# Altium schematic sheet root.SchDoc: LT3001 Eval Board - root
size 431 x 279 mm; Date: 2022-03-23; CompanyName: Team Phantom; Engineer: Justin; Revision: 1; SheetNumber: 1; SheetTotal: 1; Project: EV_LT3001; ItemRevision: 1
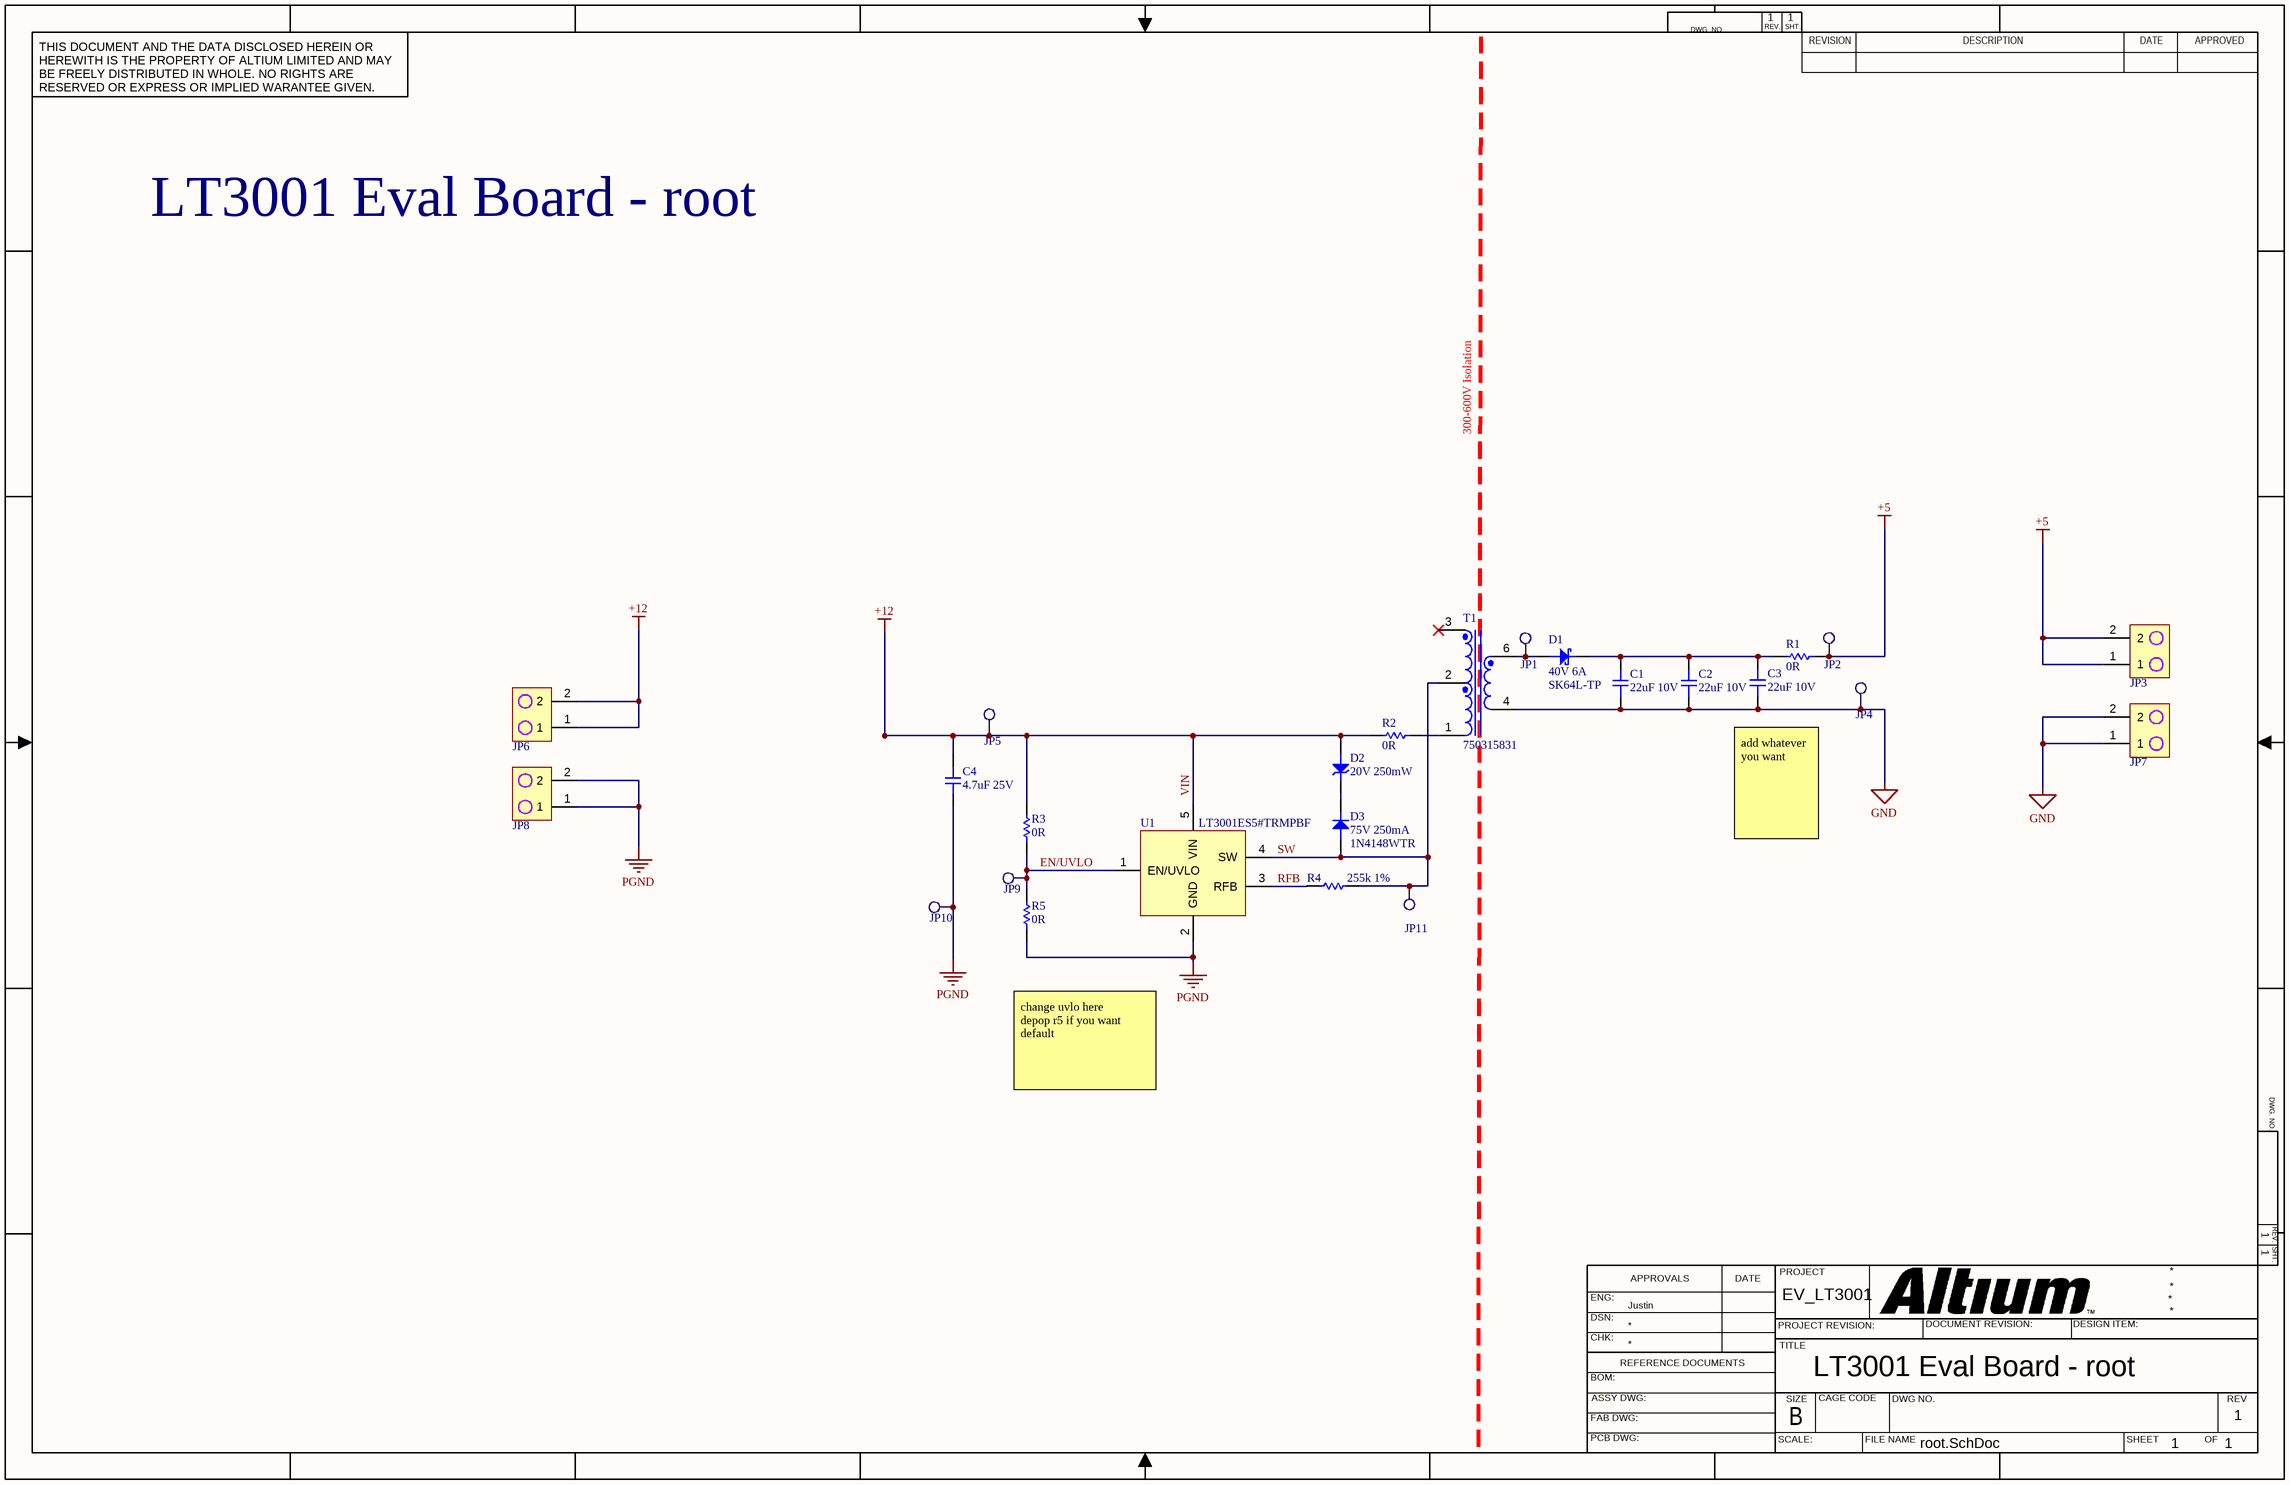
[diagram p0: root.SchDoc]

## Parts
C1  Schematic Label: 22uF 10V  [CAP-0603]  (hidden comment: CL10A226MP8NUNE)
C2  Schematic Label: 22uF 10V  [CAP-0603]  (hidden comment: CL10A226MP8NUNE)
C3  Schematic Label: 22uF 10V  [CAP-0603]  (hidden comment: CL10A226MP8NUNE)
C4  Schematic Label: 4.7uF 25V  [CAP-0805]  (hidden comment: CL21A475KAQNNNE)
D1  Schematic Label: 40V 6A  [Diode-SOD123W]  (hidden comment: SK64L-TP)
D2  Schematic Label: 20V 250mW  [DIODE-SOD323]  (hidden comment: CMDZ5250B TR PBFREE)
D3  Schematic Label: 75V 250mA  [DIODE-SOD123]  (hidden comment: 1N4148WTR)
JP1  Testpoint2  [TP2]  (value not drawn)
JP2  Testpoint2  [TP2]  (value not drawn)
JP3  732-5315-ND  [2PIN-JP]  (value not drawn)
JP4  Testpoint2  [TP2]  (value not drawn)
JP5  Testpoint2  [TP2]  (value not drawn)
JP6  732-5315-ND  [2PIN-JP]  (value not drawn)
JP7  732-5315-ND  [2PIN-JP]  (value not drawn)
JP8  732-5315-ND  [2PIN-JP]  (value not drawn)
JP9  Testpoint2  [TP2]  (value not drawn)
JP10  Testpoint2  [TP2]  (value not drawn)
JP11  Testpoint2  [TP2]  (value not drawn)
R1  0R  [RES-0603]
R2  0R  [RES-0603]
R3  0R  [RES-0603]
R4  Schematic Label: 255k 1%  [RES-0603]  (hidden comment: RMCF0603FT255K)
R5  0R  [RES-0603]
T1  750315831  [750315831]
U1  LT3001ES5#TRMPBF  [SOT95P280X100-5N]

## Nets
+5: JP2.1 JP3.1 JP3.2 R1.1
GND: C1.1 C2.1 C3.1 JP4.1 JP7.1 JP7.2 T1.4
PGND: C4.1 JP8.1 JP8.2 JP10.1 R5.1 U1.2(GND)
VIN: C4.2 D2.2 JP5.1 JP6.1 JP6.2 R2.2 R3.2 U1.5(VIN)  [also labelled +12]
EN/UVLO: JP9.1 R3.1 R5.2 U1.1(EN/UVLO)
RFB: R4.1 U1.3(RFB)
SW: D3.2 JP11.1 R4.2 T1.2 U1.4(SW)
NetC1_2: C1.2 C2.2 C3.2 D1.1 R1.2
NetD1_2: D1.2 JP1.1 T1.6
NetD2_1: D2.1 D3.1
NetR2_1: R2.1 T1.1

Not connected (* = marked no-connect by the designer): T1 3*

## Notes on the sheet
- 300-600V Isolation
- (near C3) add whatever you want
- change uvlo here
  depop r5 if you want default
- DWG. NO.
- REV.
- SHT.
- THIS DOCUMENT AND THE DATA DISCLOSED HEREIN OR HEREWITH IS THE PROPERTY OF ALTIUM LIMITED AND MAY BE FREELY DISTRIBUTED IN WHOLE. NO RIGHTS ARE RESERVED OR EXPRESS OR IMPLIED WARANTEE GIVEN.
- REVISION
- DESCRIPTION
- DATE
- APPROVED
- ENG:
- APPROVALS
- PROJECT
- DSN:
- CHK:
- REFERENCE DOCUMENTS
- PROJECT REVISION:
- TITLE
- DOCUMENT REVISION:
- DESIGN ITEM:
- BOM:
- FAB DWG:
- PCB DWG:
- ASSY DWG:
- SCALE:
- SIZE
- B
- CAGE CODE
- FILE NAME
- DWG NO.
- SHEET
- OF
- REV

## Library data of the parts
C1-C3 = Cap_22uf_10V_0603: CAP CER 22UF 10V X5R 0603; Manufacturer: Samsung; Tolerance: 20%; Supplier 1: Digi-Key; Manufacturer Part Number: CL10A226MP8NUNE; RoHS: Yes; Category: Ceramic Capacitors; Stock 1: 925394; Pricing 1: 1=0.20000, 10=0.13900, 50=0.07900, 100=0.06550, 500=0.04590, 1000=0.03800 (USD); Mount: Surface Mount; Case/Package: 0603; Case Code (Metric): 1608; Case Code (Imperial): 0603; Contact Plating: Tin; Min Operating Temperature: -55°C; Max Operating Temperature: 85°C; Packaging: Tape and Reel; Capacitance: 22uF; Voltage Rating: 10V; Dielectric: X5R; Series: CL; Construction: Flat; Length: 1.6mm; Width: 0.031inch; Height: 0.8mm; Thickness: 0.035inch; Depth: 0.8mm; Radiation Hardening: No; Lead Free: Lead Free; RoHS Compliant: Yes; ComponentLink1URL: https://datasheet.ciiva.com/25711/cl10a226mp8nune-25711532.pdf?src-supplier=Digi-Key; ComponentLink1Description: https://datasheet.ciiva.com/25711/cl10a226mp8nune-25711532.pdf?src-supplier=Digi-Key; ComponentLink2URL: https://datasheet.ciiva.com/26838/getdatasheetpartid-746477-26838370.pdf?src-supplier=Verical; ComponentLink2Description: https://datasheet.ciiva.com/26838/getdatasheetpartid-746477-26838370.pdf?src-supplier=Verical; Supplier Part Number 1: 1276-1274-1-ND
C4 = Cap_4.7uF_25V_0805: CAP CER 4.7UF 25V X5R 0805; Manufacturer: Samsung; Tolerance: 10%; Supplier 1: Digi-Key; Manufacturer Part Number: CL21A475KAQNNNE; RoHS: Yes; Category: Ceramic Capacitors; Stock 1: 5685991; Pricing 1: 1=0.11000, 10=0.08000, 50=0.04520, 100=0.03740, 500=0.02624, 1000=0.02172 (USD); Mount: Surface Mount; Case/Package: 0805; Case Code (Metric): 2012; Case Code (Imperial): 0805; Min Operating Temperature: -55°C; Max Operating Temperature: 85°C; Package Quantity: 1; Packaging: Tape and Reel; Capacitance: 4.7uF; Voltage Rating: 25V; Dielectric: X5R; Voltage Rating (DC): 25V; Series: CL; Construction: Flat; Length: 2mm; Width: 0.049inch; Height: 1.25mm; Thickness: 0.055inch; Depth: 1.25mm; Radiation Hardening: No; Lead Free: Lead Free; RoHS Compliant: Yes; ComponentLink1URL: https://datasheet.ciiva.com/25798/cl21a475kaqnnne-25798882.pdf?src-supplier=Digi-Key; ComponentLink1Description: https://datasheet.ciiva.com/25798/cl21a475kaqnnne-25798882.pdf?src-supplier=Digi-Key; Supplier Part Number 1: 1276-1244-1-ND
D1 = Diode_Schottky_40V_6A: 6 AMP SCHOTTKY RECTIFIER 20 TO 100 VOLTS; Manufacturer: MCC; Supplier 1: Digi-Key; RoHS: Yes; Category: Uncategorized; Stock 1: 62; Pricing 1: 1=0.62000, 10=0.54400, 100=0.41740, 500=0.33000, 1000=0.26400 (USD); Case/Package: 100; RoHS Compliant: Yes; ComponentLink1URL: http://components.arrow.com/part/dataview/48985430S301820N2022?src-supplier=Arrow+Electronics; ComponentLink1Description: http://components.arrow.com/part/dataview/48985430S301820N2022?src-supplier=Arrow+Electronics; Supplier Part Number 1: SK64L-TPMSCT-ND; Manufacturer Part Number: SK64L-TP
D2 = Diode_Zener_20V_250mW: Diode Zener Single 20V 5% 250mW 2-Pin SOD-323 T/R; Manufacturer: Central Semiconductor; Supplier 1: Digi-Key; RoHS: Yes; Category: Zener Diodes; Stock 1: 9615; Pricing 1: 1=0.74000, 10=0.65300, 100=0.50090, 500=0.39600, 1000=0.31680 (USD); RoHS Compliant: Yes; Supplier Part Number 1: 1514-CMDZ5250BTRPBFREECT-ND; Manufacturer Part Number: CMDZ5250B TR PBFREE
D3 = Diode-75V-250mA: Diode Gen Purp 75V 250MA SOD123; Manufacturer: SMC; Reverse Recovery Time: 4ns; ComponentLink5URL: https://datasheet.ciiva.com/916/1n914bwt-916866.pdf?src-supplier=Digi-Key; ComponentLink5Description: https://datasheet.ciiva.com/916/1n914bwt-916866.pdf?src-supplier=Digi-Key; ComponentLink7URL: https://datasheet.ciiva.com/916/1n914bwt-916864.pdf?src-supplier=Digi-Key; ComponentLink7Description: https://datasheet.ciiva.com/916/1n914bwt-916864.pdf?src-supplier=Digi-Key; Supplier 1: Future Electronics; RoHS: No; Category: Rectifier Diodes; Stock 1: 3000; Pricing 1: 3000=0.01700, 12000=0.01430, 45000=0.01400, 90000=0.01380, 225000=0.01360 (USD); Mount: Surface Mount; Packaging: Tape and Reel; Max Reverse Voltage (DC): 75V; Average Rectified Current: 250mA; ComponentLink1URL: http://www.smc-diodes.com/propdf/1N4148W%20N0571%20REV.D.pdf?src-supplier=Digi-Key; ComponentLink1Description: http://www.smc-diodes.com/propdf/1N4148W%20N0571%20REV.D.pdf?src-supplier=Digi-Key; Supplier Part Number 1: 7059449; Manufacturer Part Number: 1N4148WTR
JP1 JP2 JP4 JP5 JP9-JP11 = Testpoint2: Single layer pad TP
JP3 JP6-JP8 = 2PIN-TEST: CONN HEADER VERT 2POS 2.54MM
R1-R3 R5 = 0603-0R: RES SMD 0 OHM JUMPER 1/10W 0603; Manufacturer: Yageo; Manufacturer Part Number: RC0603JR-070RL; Resistance: 0mR; Tolerance: 1%; Voltage Rating: 50V; Power Rating: 100mW; Temperature Coefficient: 200ppm/°C; Supplier 1: Digi-Key; Stock 1: 25658294; Pricing 1: 1=0.1, 10=0.019, 25=0.0136, 50=0.0104, 100=0.0077, 250=0.00588, 500=0.00472, 1000=0.00347 (USD); Case/Package: 0603; Number of Pins: 2; Case Code (Imperial): 0603; Case Code (Metric): 1608; Contact Plating: Tin,Matte; Min Operating Temperature: -55°C; Max Operating Temperature: 155°C; Package Quantity: 5000; Packaging: Tape and Reel; Voltage Rating (DC): 50V; Termination: SMD/SMT; Composition: Thick Film; Military Standard: Not; Length: 1.6mm; Height: 0.45mm; Width: 0.8mm; Depth: 0.8mm; Radiation Hardening: No; REACH SVHC: No SVHC; Lead Free: Lead Free; ComponentLink1URL: http://www.farnell.com/datasheets/2167052.pdf?src-supplier=Element14; ComponentLink1Description: http://www.farnell.com/datasheets/2167052.pdf?src-supplier=Element14; ComponentLink2URL: https://www.verical.com/server-webapp/html/getDatasheet?partID=329462&src-supplier=Verical; ComponentLink2Description: https://www.verical.com/server-webapp/html/getDatasheet?partID=329462&src-supplier=Verical; ComponentLink3URL: http://www.yageo.com/documents/recent/PYu-RC_Group_51_RoHS_L_9.pdf?src-supplier=Mouser; ComponentLink3Description: http://www.yageo.com/documents/recent/PYu-RC_Group_51_RoHS_L_9.pdf?src-supplier=Mouser; ComponentLink4URL: http://www.farnell.com/datasheets/443971.pdf?src-supplier=Element14; ComponentLink4Description: http://www.farnell.com/datasheets/443971.pdf?src-supplier=Element14; ComponentLink5URL: http://documents.rs-components.com/techlib://itc_doclist_GB.htm?stockno=6515918&src-supplier=RSComponents; ComponentLink5Description: http://documents.rs-components.com/techlib://itc_doclist_GB.htm?stockno=6515918&src-supplier=RSComponents; Supplier Part Number 1: 311-0.0GRCT-ND
R4 = 0603-255KR: Res Thick Film 0603 255K Ohm 1% 1/10W ±100ppm/°C Molded SMD SMD Paper T/R; Manufacturer: Stackpole Electronics; Resistance: 255kR; Max Power Dissipation: 100mW; Supplier 1: Digi-Key; Manufacturer Part Number: RMCF0603FT255K; RoHS: Yes; Category: Chip SMD Resistors; Stock 1: 69978; Pricing 1: 1=0.10000, 10=0.01700, 100=0.00680, 1000=0.00305, 2500=0.00264 (USD); Mount: Surface Mount; Case/Package: 0603; Case Code (Metric): 1608; Case Code (Imperial): 0603; Contact Plating: Tin,Matte; Min Operating Temperature: -55°C; Max Operating Temperature: 155°C; Packaging: Tape and Reel; Tolerance: 1%; Resistor Type: Thick Film; Number of Terminations: 2; Temperature Coefficient: 100ppm/°C; Features: Automotive AEC-Q200; Series: RMCF; Construction: Rectangular; Length: 0.061inch; Width: 0.031inch; Height: 0.022inch; Depth: 0.8mm; Radiation Hardening: No; Military Standard: Not; RoHS Compliant: Yes; ComponentLink1URL: https://www.seielect.com/catalog/SEI-Packaging.pdf?src-supplier=Digi-Key; ComponentLink1Description: https://www.seielect.com/catalog/SEI-Packaging.pdf?src-supplier=Digi-Key; ComponentLink2URL: https://www.seielect.com/Catalog/SEI-RMCF_RMCP.pdf?src-supplier=Digi-Key; ComponentLink2Description: https://www.seielect.com/Catalog/SEI-RMCF_RMCP.pdf?src-supplier=Digi-Key; ComponentLink3URL: http://components.arrow.com/part/dataview/40961324S7493834N1174?src-supplier=Arrow+Electronics; ComponentLink3Description: http://components.arrow.com/part/dataview/40961324S7493834N1174?src-supplier=Arrow+Electronics; ComponentLink4URL: https://www.seielect.com/catalog/SEI-RMCF_RMCP.pdf?src-supplier=Avnet; ComponentLink4Description: https://www.seielect.com/catalog/SEI-RMCF_RMCP.pdf?src-supplier=Avnet; ComponentLink5URL: https://www.verical.com/server-webapp/html/getDatasheet?partID=714409&src-supplier=Verical; ComponentLink5Description: https://www.verical.com/server-webapp/html/getDatasheet?partID=714409&src-supplier=Verical; Supplier Part Number 1: RMCF0603FT255KCT-ND
T1 = Xfmr_750315831: Flyback Converters For For DC/DC Converters SMPS Transformer 1875Vrms Isolation 50 ~ 200kHz Surface Mount; Manufacturer: Wurth Electronics Midcom; Supplier 1: Digi-Key; RoHS: Yes; Stock 1: 388; Pricing 1: 1=2.64000, 10=2.50800, 50=2.33200, 100=2.11200 (USD); Mount: Surface Mount; Min Operating Temperature: -40°C; Max Operating Temperature: 125°C; Packaging: Cut Tape; Frequency: 200kHz; RoHS Compliant: No; ComponentLink1URL: https://katalog.we-online.com/ctm/datasheet/750315831.pdf?src-supplier=Digi-Key; ComponentLink1Description: https://katalog.we-online.com/ctm/datasheet/750315831.pdf?src-supplier=Digi-Key; Supplier Part Number 1: 1297-1244-1-ND; Manufacturer Part Number: 750315831
U1 = IC_LT3001: DC/DC Cntrlr Single-OUT Flyback Automotive 5-Pin TSOT-23 T/R; Manufacturer: Analog Devices; Supplier 1: Digi-Key; RoHS: Yes; Category: Voltage Regulators - Switching; Pricing 1: 1=5.73000, 10=5.14700, 25=4.86560, 100=4.21670, 250=4.00044 (USD); Supplier Part Number 1: 505-LT3001ES5#TRMPBFCT-ND; Manufacturer Part Number: LT3001ES5#TRMPBF